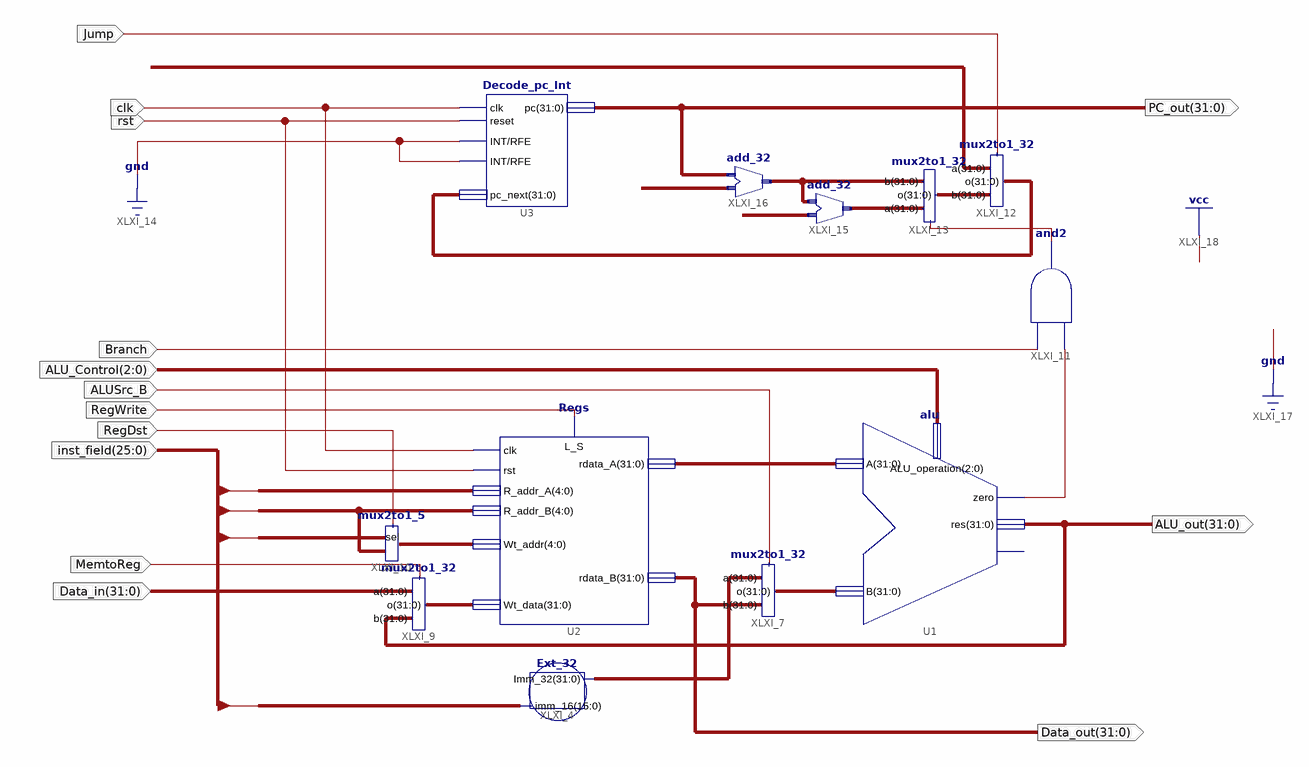
[diagram p0: schematic sheet 1]
// Xilinx ISE schematic Data_path.sch (spartan6) as structural Verilog: 12 symbols, 14 ports
module Data_path (
  input  MemtoReg,
  input  [31:0] Data_in,
  input  [25:0] inst_field,
  input  RegDst,
  input  [2:0] ALU_Control,
  input  RegWrite,
  input  ALUSrc_B,
  input  Branch,
  input  rst,
  input  clk,
  input  Jump,
  output [31:0] Data_out,
  output [31:0] ALU_out,
  output [31:0] PC_out
);

  wire XLXN_23, XLXN_28;
  wire [4:0] XLXN_14;
  wire [31:0] Imm_32, XLXN_1, XLXN_2, XLXN_6, XLXN_27, XLXN_29, XLXN_39, XLXN_40;
  wire [31:28] pc_4;

  Regs U2 (
    .clk(clk), .L_S(RegWrite), .rdata_A(XLXN_1), .rst(rst), .Wt_data(XLXN_6), .rdata_B(Data_out),
    .R_addr_A(inst_field[25:21]), .R_addr_B(inst_field[20:16]), .Wt_addr(XLXN_14));
  alu U1 (.zero(XLXN_23), .res(ALU_out), .A(XLXN_1), .B(XLXN_2), .ALU_operation(ALU_Control));  // open: overflow
  Decode_pc_Int U3 (.clk(clk), .pc(PC_out), .reset(rst), .INT(1'b0), .RFE(1'b0), .pc_next(XLXN_29));
  Ext_32 XLXI_4 (.imm_16(inst_field[15:0]), .Imm_32(Imm_32));
  mux2to1_32 XLXI_7 (.sel(ALUSrc_B), .a(Imm_32), .b(Data_out), .o(XLXN_2));
  mux2to1_32 XLXI_9 (.sel(MemtoReg), .a(Data_in), .b(ALU_out), .o(XLXN_6));
  mux2to1_5 XLXI_10 (.sel(RegDst), .o(XLXN_14), .b(inst_field[20:16]), .a(inst_field[15:11]));
  and XLXI_11 (XLXN_28, XLXN_23, Branch);
  mux2to1_32 XLXI_12 (.sel(Jump), .a({pc_4, inst_field, 2'b00}), .b(XLXN_27), .o(XLXN_29));
  mux2to1_32 XLXI_13 (.sel(XLXN_28), .a(XLXN_40), .b(XLXN_39), .o(XLXN_27));
  add_32 XLXI_15 (.a(XLXN_39), .b({Imm_32[29:0], 2'b00}), .c(XLXN_40));
  add_32 XLXI_16 (.a(PC_out), .b(32'b00000000000000000000000000000100), .c(XLXN_39));
endmodule
